# EAGLE design RPi_Secure_v1_2 (EAGLE 6.6.0)
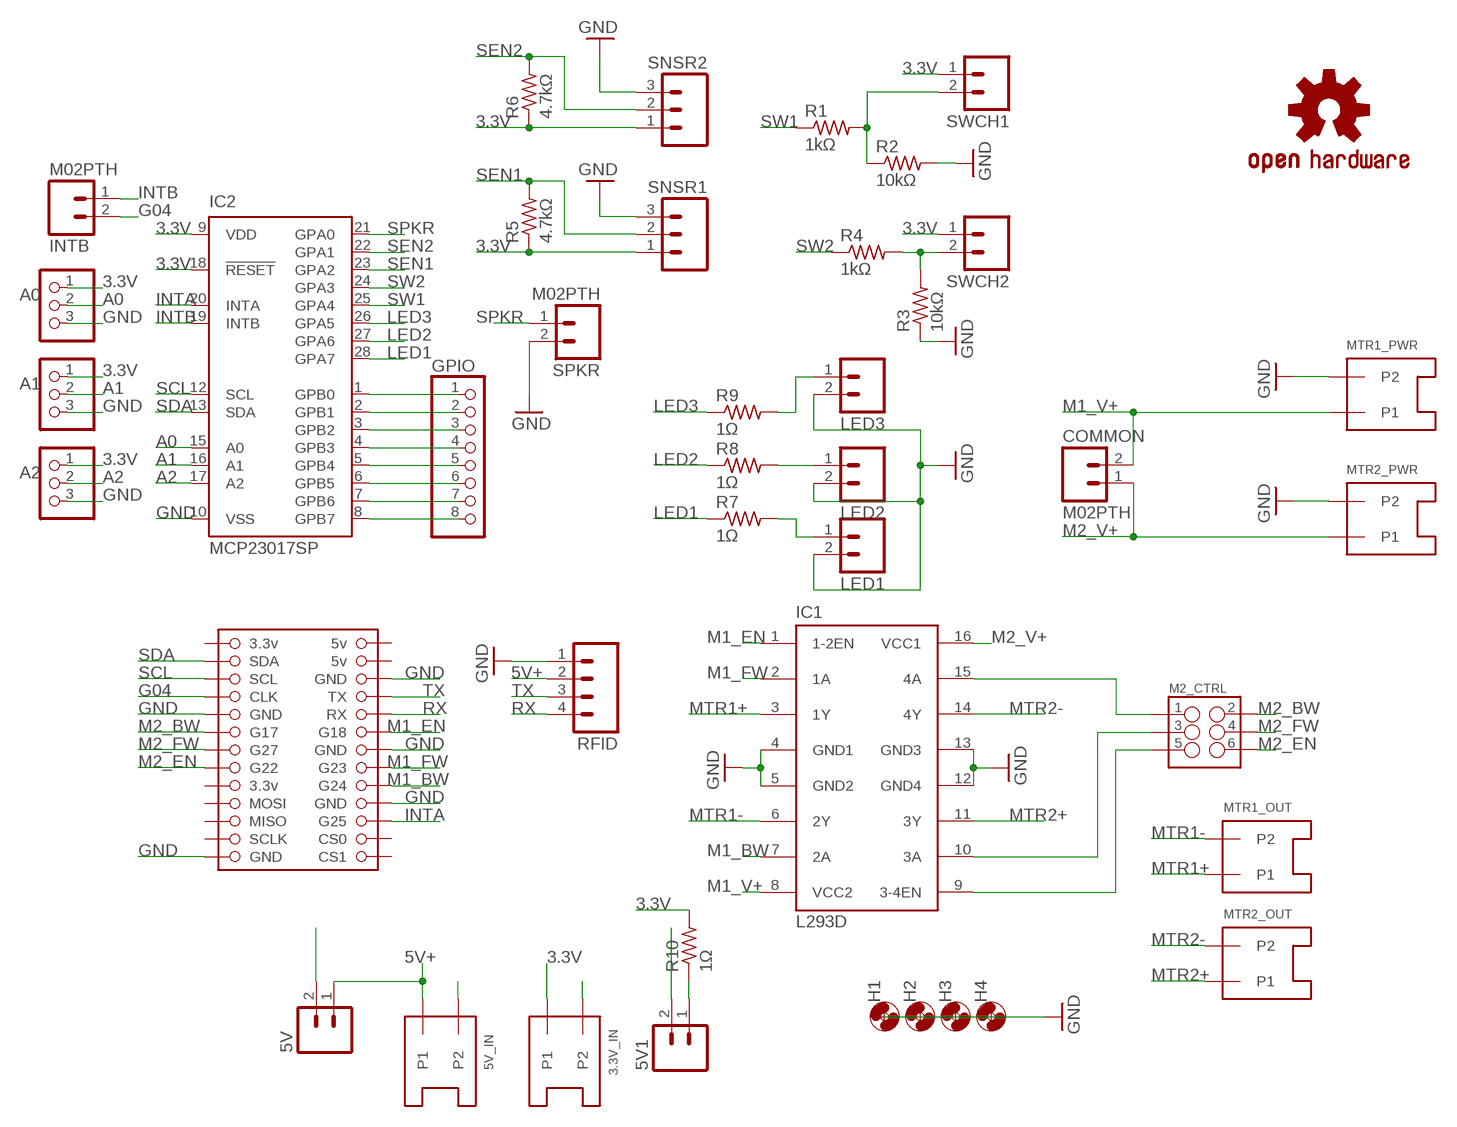
[diagram p0: schematic, sheet 1]

## Parts
3.3V_IN  S2B-XH-AS2B-XH-A  [S2B-XH-A]
5V  M02PTH  [1X02]
5V1  M02PTH  [1X02]
5V_IN  S2B-XH-AS2B-XH-A  [S2B-XH-A]
A0  PINHD-1X3  [1X03]
A1  PINHD-1X3  [1X03]
A2  PINHD-1X3  [1X03]
COMMON  M02PTH  [1X02]
GPIO  PINHD-1X8  [1X08]
H1  MOUNT-HOLE2.8  [2,8]
H2  MOUNT-HOLE2.8  [2,8]
H3  MOUNT-HOLE2.8  [2,8]
H4  MOUNT-HOLE2.8  [2,8]
IC1  L293D  [DIL16]
IC2  MCP23017SP  [DIL28-3]
INTB  M02PTH  [1X02]
JP1  1112RPI_EXTRA_LONG  [1112]
LED1  M02PTH  [1X02]
LED2  M02PTH  [1X02]
LED3  M02PTH  [1X02]
LOGO2  OSHW-LOGOM  [OSHW-LOGO-M]
M2_CTRL  M03X22X3_SILK_SM  [2X3]
MTR1_OUT  S2B-XH-AS2B-XH-A  [S2B-XH-A]
MTR1_PWR  S2B-XH-AS2B-XH-A  [S2B-XH-A]
MTR2_OUT  S2B-XH-AS2B-XH-A  [S2B-XH-A]
MTR2_PWR  S2B-XH-AS2B-XH-A  [S2B-XH-A]
R1  1kΩ  R-US_R0805  [R0805]
R2  10kΩ  R-US_R0805  [R0805]
R3  10kΩ  R-US_R0805  [R0805]
R4  1kΩ  R-US_R0805  [R0805]
R5  4.7kΩ  R-US_R0805  [R0805]
R6  4.7kΩ  R-US_R0805  [R0805]
R7  1Ω  R-US_R0805  [R0805]
R8  1Ω  R-US_R0805  [R0805]
R9  1Ω  R-US_R0805  [R0805]
R10  1Ω  R-US_R0805  [R0805]
RFID  M04PTH  [1X04]
SNSR1  M03PTH  [1X03]
SNSR2  M03PTH  [1X03]
SPKR  M02PTH  [1X02]
SWCH1  M02PTH  [1X02]
SWCH2  M02PTH  [1X02]

## Nets
3.3V: 3.3V_IN.P1 A0.1 A1.1 A2.1 IC2.9(VDD) IC2.18(!RESET) R5.1 R6.1 R10.2 SNSR1.1 SNSR2.1 SWCH1.1 SWCH2.1
5V+ [power]: 5V.1 5V_IN.P1 RFID.2
A0: A0.2 IC2.15(A0)
A1: A1.2 IC2.16(A1)
A2: A2.2 IC2.17(A2)
G04: INTB.2 JP1.07
GND: 3.3V_IN.P2 5V1.2 5V.2 5V_IN.P2 A0.3 A1.3 A2.3 IC1.4(GND1) IC1.5(GND2) IC1.12(GND4) IC1.13(GND3) IC2.10(VSS) JP1.06 JP1.09 JP1.14 JP1.20 JP1.25 LED1.2 LED2.2 LED3.2 MTR1_PWR.P2 MTR2_PWR.P2 R2.2 R3.1 RFID.1 SNSR1.3 SNSR2.3 SPKR.2
INTA: IC2.20(INTA) JP1.22
INTB: IC2.19(INTB) INTB.1
LED1: IC2.28(GPA7) R7.1
LED2: IC2.27(GPA6) R8.1
LED3: IC2.26(GPA5) R9.1
M1_BW: IC1.7(2A) JP1.18
M1_EN: IC1.1(1-2EN) JP1.12
M1_FW: IC1.2(1A) JP1.16
M1_V+ [power]: COMMON.2 IC1.8(VCC2) MTR1_PWR.P1
M2_BW: JP1.11 M2_CTRL.2
M2_EN: JP1.15 M2_CTRL.6
M2_FW: JP1.13 M2_CTRL.4
M2_V+ [power]: COMMON.1 IC1.16(VCC1) MTR2_PWR.P1
MTR1+ [power]: IC1.3(1Y) MTR1_OUT.P1
MTR1- [power]: IC1.6(2Y) MTR1_OUT.P2
MTR2+ [power]: IC1.11(3Y) MTR2_OUT.P1
MTR2- [power]: IC1.14(4Y) MTR2_OUT.P2
N$1: LED1.1 R7.2
N$2: LED2.1 R8.2
N$3: LED3.1 R9.2
N$4: R3.2 R4.2 SWCH2.2
N$6: 5V1.1 R10.1
N$17: IC1.10(3A) M2_CTRL.3
N$18: IC1.15(4A) M2_CTRL.1
N$20: GPIO.1 IC2.1(GPB0)
N$21: GPIO.2 IC2.2(GPB1)
N$22: GPIO.3 IC2.3(GPB2)
N$23: GPIO.4 IC2.4(GPB3)
N$24: GPIO.5 IC2.5(GPB4)
N$25: GPIO.6 IC2.6(GPB5)
N$26: GPIO.7 IC2.7(GPB6)
N$27: GPIO.8 IC2.8(GPB7)
RX: JP1.10 RFID.4
SCL: IC2.12(SCL) JP1.05
SDA: IC2.13(SDA) JP1.03
SEN1: IC2.23(GPA2) R5.2 SNSR1.2
SEN2: IC2.22(GPA1) R6.2 SNSR2.2
SPKR: IC2.21(GPA0) SPKR.1
SW1: IC2.25(GPA4) R1.1 R1.2 R2.1 SWCH1.2
SW2: IC2.24(GPA3) R4.1
TX: JP1.08 RFID.3
X: IC1.9(3-4EN) M2_CTRL.5
Unconnected: JP1.19 JP1.21 JP1.23 JP1.24 JP1.26

## Power pins joined to a net without a drawn wire
01: JP1.01
02: JP1.02
04: JP1.04
17: JP1.17

## Library data of the parts
3.3V_IN 5V_IN MTR1_OUT MTR1_PWR MTR2_OUT MTR2_PWR = con-jst2:S2B-XH-A
5V 5V1 COMMON INTB LED1-LED3 SPKR SWCH1 SWCH2 = SparkFun-Connectors:M02: Standard 2-pin 0.1" header. Use with - straight break away headers ( PRT-00116) - right angle break away headers (PRT-00553) - swiss pins (PRT-00743) - machine pins (PRT-00117) - female headers (PRT-00115) Molex polarized connector foot print use with: PRT-08233 with associated crimp pins and housings. 2.54_SCREWTERM for use with PRT-10571. 3.5mm Screw Terminal footprints for PRT-08084 5mm Screw Terminal footprints for use with PRT-08433; MF: MOLEX; MPN: 22-28-4023; OC_NEWARK: 92C2171
A0 A1 A2 = adafruit2:PINHD-1X3: PIN HEADER; MPN: 22-28-4033; OC_NEWARK: 87K0730
GPIO = pinhead:PINHD-1X8: PIN HEADER; MF: MOLEX; MPN: 22-28-4080; OC_NEWARK: 56H2000
H1-H4 = holes:MOUNT-HOLE: MOUNTING HOLE with drill center marker
IC1 = st-microelectronics:L293D: PUSH-PULL 4 CHANNEL DRIVER; MPN: L293D; OC_FARNELL: 9589619; OC_NEWARK: 56P8249
IC2 = adafruit2:MCP23017: http://ww1.microchip.com/downloads/en/DeviceDoc/21952a.pdf Source: http://ww1.microchip.com/downloads/en/DeviceDoc/21952a.pdf; MF: MICROCHIP; MPN: MCP23017-E/SP; OC_NEWARK: 31K2959
JP1 = adafruit2:1112: PIN HEADER; OC_NEWARK: unknown
LOGO2 = SparkFun-Aesthetics:OSHW-LOGO: Open Source Hardware Logo This logo indicates the piece of hardware it is found on incorporates a OSHW license and/or adheres to the definition of open source hardware found here: http://freedomdefined.org/OSHW; OC_NEWARK: unknown
M2_CTRL = SparkFun-Connectors:M03X2: 2x3 .1" header. Shrouded, with keying- CONN-10681 SMT- CONN-11415 Pogo pins- HW-11044; OC_NEWARK: unknown
R1-R10 = resistor:R-US_: RESISTOR, American symbol
RFID = SparkFun-Connectors:M04: Header 4 Standard 4-pin 0.1" header. Use with straight break away headers (SKU : PRT-00116), right angle break away headers (PRT-00553), swiss pins (PRT-00743), machine pins (PRT-00117), and female headers (PRT-00115). Molex polarized connector foot print use with SKU : PRT-08231 with associated crimp pins and housings. 1MM SMD Version SKU: PRT-10208; MPN: 22-28-4040; OC_NEWARK: 29X1962
SNSR1 SNSR2 = SparkFun-Connectors:M03: Header 3 Standard 3-pin 0.1" header. Use with straight break away headers (SKU : PRT-00116), right angle break away headers (PRT-00553), swiss pins (PRT-00743), machine pins (PRT-00117), and female headers (PRT-00115). Molex polarized connector foot print use with SKU : PRT-08232 with associated crimp pins and housings.; MPN: 22-28-4033; OC_NEWARK: 87K0730

## Net classes
1 power: width 0.607 mm, clearance 0.305 mm

## Board
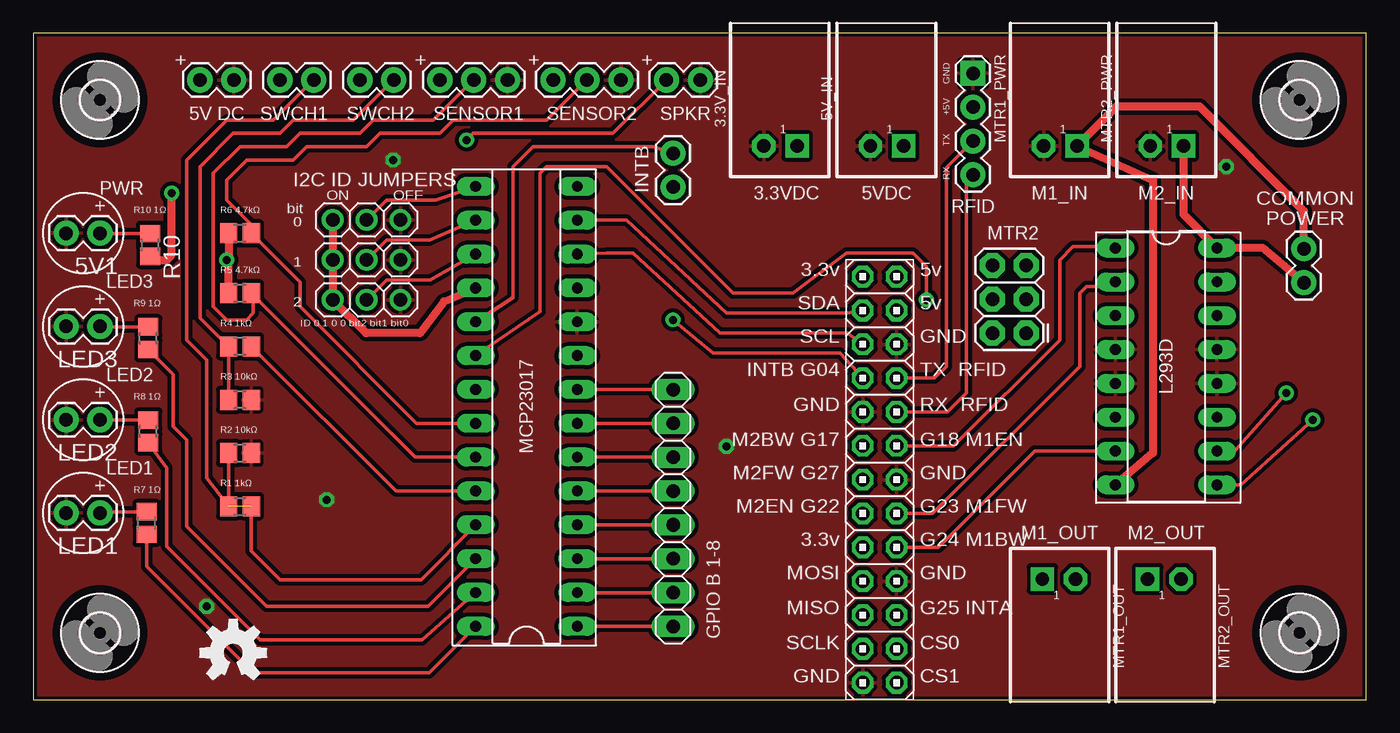
[diagram p1: board, top side]
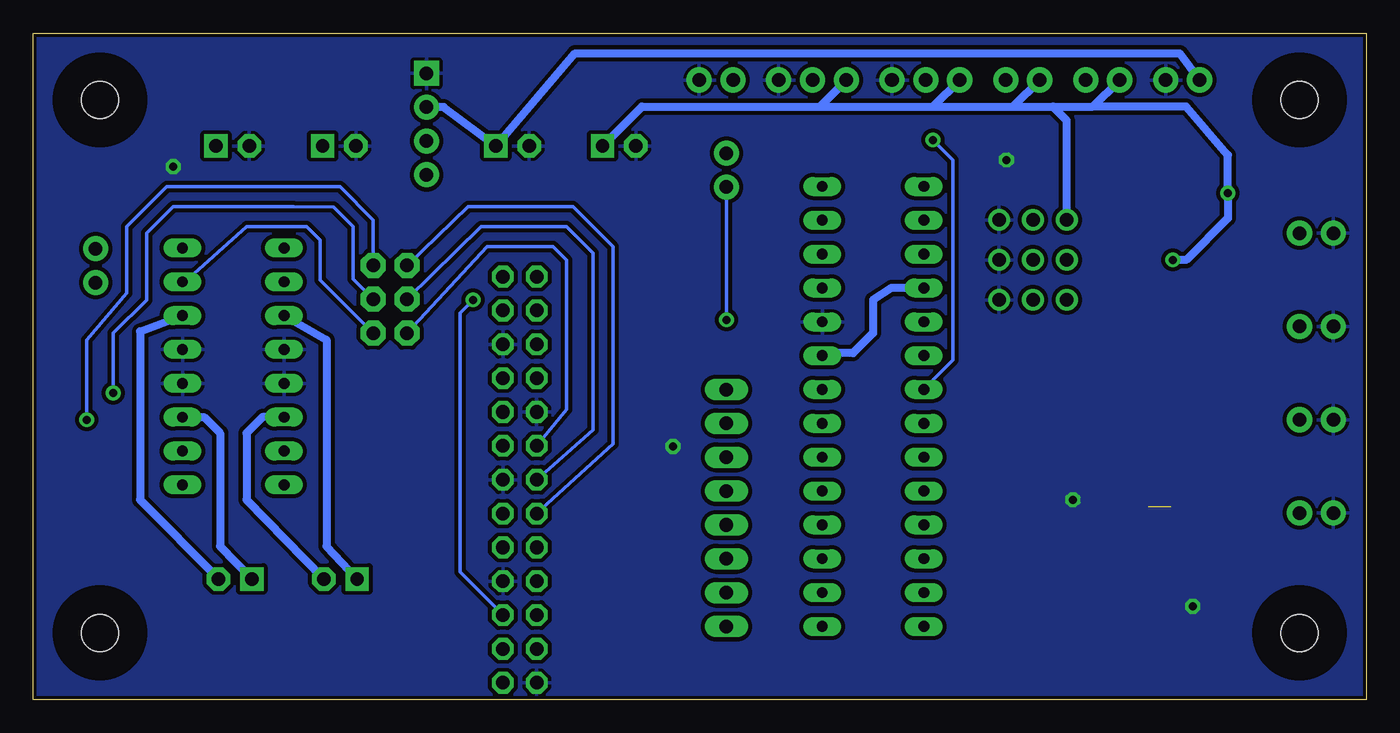
[diagram p2: board, bottom side, seen from below]

Size 100 x 50 mm. Coordinates in mm from the lower left corner, seen from the top.
Outline: 0,0 100,0 100,50 0,50 0,0
Copper layers (1*2*15*16): Top 0.035mm / dielectric 0.2mm / layer 2 0.0175mm / dielectric 1.1mm / layer 15 0.0175mm / dielectric 0.2mm / Bottom 0.035mm
Design rules "SeeedStudio_DRU_no_angle_20130527 *": minimum track width 6mil, minimum drill 12mil, track to track 12mil, track to pad 12mil, pad to pad 12mil, via to via 12mil, smd to smd 0mil, copper to edge 10mil, drill to drill 10mil, minimum pad ring 12mil, minimum via ring 10mil, stop-mask expansion 2mil, vias tented up to drill 25mil, thermal gap 10mil

### Footprints (pad centres in the part's own frame; a part is rotated, then mirrored left to right if it is on the bottom)
S2B-XH-A = drill 1 pad 1.75 square: P1 1.3,-3.45 | drill 1 pad 1.75 octagon: P2 -1.2,-3.45
1X02 = drill 1.016 pad 1.88: 1 0,0; 2 2.54,0
1X03 = drill 1.016: 1 -2.54,0; 2 0,0; 3 2.54,0
1X08 = drill 1.016 long: 1 -8.89,0; 2 -6.35,0; 3 -3.81,0; 4 -1.27,0; 5 1.27,0; 6 3.81,0; 7 6.35,0; 8 8.89,0
2,8 = hole 2.8: 0,0
DIL16 = drill 0.813 long: 1 -8.89,-3.81; 2 -6.35,-3.81; 3 -3.81,-3.81; 4 -1.27,-3.81; 5 1.27,-3.81; 6 3.81,-3.81; 7 6.35,-3.81; 8 8.89,-3.81; 9 8.89,3.81; 10 6.35,3.81; 11 3.81,3.81; 12 1.27,3.81; 13 -1.27,3.81; 14 -3.81,3.81; 15 -6.35,3.81; 16 -8.89,3.81
DIL28-3 = drill 0.813 long: 1 -16.51,-3.81; 2 -13.97,-3.81; 3 -11.43,-3.81; 4 -8.89,-3.81; 5 -6.35,-3.81; 6 -3.81,-3.81; 7 -1.27,-3.81; 8 1.27,-3.81; 9 3.81,-3.81; 10 6.35,-3.81; 11 8.89,-3.81; 12 11.43,-3.81; 13 13.97,-3.81; 14 16.51,-3.81; 15 16.51,3.81; 16 13.97,3.81; 17 11.43,3.81; 18 8.89,3.81; 19 6.35,3.81; 20 3.81,3.81; 21 1.27,3.81; 22 -1.27,3.81; 23 -3.81,3.81; 24 -6.35,3.81; 25 -8.89,3.81; 26 -11.43,3.81; 27 -13.97,3.81; 28 -16.51,3.81
1112 = drill 1.016 octagon: 01 -1.27,15.24; 02 1.27,15.24; 03 -1.27,12.7; 04 1.27,12.7; 05 -1.27,10.16; 06 1.27,10.16; 07 -1.27,7.62; 08 1.27,7.62; 09 -1.27,5.08; 10 1.27,5.08; 11 -1.27,2.54; 12 1.27,2.54; 13 -1.27,0; 14 1.27,0; 15 -1.27,-2.54; 16 1.27,-2.54; 17 -1.27,-5.08; 18 1.27,-5.08; 19 -1.27,-7.62; 20 1.27,-7.62; 21 -1.27,-10.16; 22 1.27,-10.16; 23 -1.27,-12.7; 24 1.27,-12.7; 25 -1.27,-15.24; 26 1.27,-15.24
2X3 = drill 1.016 pad 1.88 octagon: 1 0,0; 2 0,2.54; 3 2.54,0; 4 2.54,2.54; 5 5.08,0; 6 5.08,2.54
R0805 = smd 1.3 x 1.5: 1 -0.85,0; 2 0.85,0
1X04 = drill 1.016 pad 1.88 square: 1 0,0 | drill 1.016 pad 1.88: 2 2.54,0; 3 5.08,0; 4 7.62,0
1X03' = drill 1.016 pad 1.88: 1 0,0; 2 2.54,0; 3 5.08,0

### Placement (x,y rotation side)
3.3V_IN  56,45 0 top
5V  12.5,46.5 0 top
5V1  5,35 180 top
5V_IN  64,45 0 top
A0  25,36 0 top
A1  25,33 0 top
A2  25,30 0 top
COMMON  95.33,31.29 90 top
GPIO  48,14.38 90 top
H1  5,5 0 top
H2  95,5 0 top
H3  95,45 0 top
H4  5,45 0 top
IC1  85,25 270 top
IC2  37,22 90 top
INTB  48,41 270 top
JP1  63.5,16.5 0 top
LED1  5,14 180 top
LED2  5,21 180 top
LED3  5,28 180 top
LOGO2  15,3.5 0 top
M2_CTRL  74.5,27.5 90 top
MTR1_OUT  77,5.6 180 top
MTR1_PWR  77,45 0 top
MTR2_OUT  84.91,5.6 180 top
MTR2_PWR  85,45 0 top
R1  15.5,14.5 0 top
R2  15.5,18.5 0 top
R3  15.5,22.5 180 top
R4  15.5,26.5 180 top
R5  15.5,30.5 0 top
R6  15.5,35 0 top
R7  8.5,13.25 90 top
R8  8.62,20.12 90 top
R9  8.62,27.12 90 top
R10  8.75,34.12 270 top
RFID  70.5,47 270 top
SNSR1  [1X03']  30.5,46.5 0 top
SNSR2  [1X03']  39,46.5 0 top
SPKR  47.5,46.5 0 top
SWCH1  18.5,46.5 0 top
SWCH2  24.5,46.5 0 top

### Tracks (layer width: path | path; a pad name or v marks a point on that pad's centre or on a via)
3.3V  (via drill 0.6)
  Top 0.254: 14.65,33.15 v14.5,33 14.65,32.85
  Top 0.61: A0.1 A1.1 A2.1 24.96,27.5 29,27.5 30.8,29.88 IC2.18 | R10.2 9.03,33 10,33 10.38,33.38 v10.38,38 | R6.1 14.65,33.15 | R5.1 14.65,32.85
  Bottom 0.61: IC2.18 35.61,30.89 37,30 37,27.5 38.5,26 40.62,26 IC2.9 | 3.3V_IN.P1 54.35,44.5 41,44.5 | 41,44.5 32.5,44.5 | 32.5,44.5 26.5,44.5 | 26.5,44.5 23.5,44.5 | 23.5,44.5 20.5,44.5 | 20.5,44.5 SWCH1.1 | SWCH2.1 26.5,44.5 | SNSR1.1 32.5,44.5 | SNSR2.1 41,44.5 | A0.1 22.46,43.46 23.5,44.5 | 20.5,44.5 13.5,44.5 10.38,40.88 v10.38,38 10.38,36.12 13.5,33 v14.5,33
5V+
  Bottom 0.61: RFID.2 69.21,44.46 5V_IN.P1 59.35,48.5 14,48.5 5V.1
A0
  Top 0.254: A0.2 26.5,37.5 30.18,37.5 IC2.15
A1
  Top 0.254: A1.2 26.5,34.5 29.72,34.5 IC2.16
A2
  Top 0.254: A2.2 26.5,31.5 29.76,31.5 IC2.17
G04  (via drill 0.6)
  Top 0.254: JP1.07 60.5,26 51,26 v48,28.5
  Bottom 0.254: v48,28.5 INTB.2
GND  (via drill 0.6)
  other vias: 52,19 89.5,40 27,40.5 13,7 22,15
  pour Top: -0.5,50.5 101,50.5 101,-1 13,-1 13,-8.5 -0.5,-8.5
  pour Bottom: -1,51 101.5,51 101.5,-8 87,-8 87,-1.5 -1,-1.5
INTA  (via drill 0.6)
  Top 0.254: IC2.20 38,29.12 38,39.5 38.5,40 43,40 52.5,30.5 57,30.5 61,33.5 66,33.5 67,32.5 v67,30
  Bottom 0.254: JP1.22 68,9.57 68,29 v67,30
INTB
  Top 0.254: IC2.19 36,30.16 36,40 37.5,41.5 46.5,41.5 INTB.1
LED1
  Top 0.254: IC2.28 29.69,1.99 16.5,1.99 8.5,9.99 R7.1
LED2
  Top 0.254: R8.1 10,17.4 10,11.5 17,4.5 29.16,4.5 IC2.27
LED3
  Top 0.254: R9.1 10.5,24.4 10.5,20.5 11.5,19.5 11.5,13 17.5,7 29.62,7 IC2.26
M1_BW
  Top 0.254: JP1.18 67.92,11.42 75.15,18.65 IC1.7
M1_EN
  Top 0.254: JP1.12 69.04,19.04 77,27 77,33 78,34 81.08,34 IC1.1
M1_FW
  Top 0.254: JP1.16 67.46,13.96 78.5,25 78.5,30.5 79,31 80.84,31 IC1.2
M1_V+
  Top 0.61: IC1.8 84,18.5 84,39 MTR1_PWR.P1 81.25,44.5 87.5,44.5 95.33,36.67 COMMON.2
M2_BW
  Bottom 0.254: JP1.11 60,21.77 60,33 61,34 65.96,34 M2_CTRL.2
M2_EN
  Bottom 0.254: JP1.15 56.5,19.19 56.5,34 59.5,37 67.38,37 M2_CTRL.6
M2_FW
  Bottom 0.254: JP1.13 58,20.23 58,33.5 60,35.5 66.42,35.5 M2_CTRL.4
M2_V+
  Top 0.61: COMMON.1 92.23,33.89 IC1.16 86.3,36.4 MTR2_PWR.P1
MTR1+
  Bottom 0.61: IC1.3 78,27 78,11.5 MTR1_OUT.P1
MTR1-
  Bottom 0.61: IC1.6 82.81,21.19 84,20 84,15 MTR1_OUT.P2
MTR2+
  Bottom 0.61: IC1.11 87.19,21.19 86,20 86,11.5 MTR2_OUT.P1
MTR2-
  Bottom 0.61: IC1.14 92,27.62 92,15 MTR2_OUT.P2
N$1
  Top 0.254: LED1.1 5.1,14.1 R7.2
N$2
  Top 0.254: LED2.1 5.03,20.98 R8.2
N$3
  Top 0.254: LED3.1 5.03,27.98 R9.2
N$4
  Top 0.254: R3.2 R4.2 12.5,28.65 12.5,40 15,42.5 18.5,42.5 19.5,43.5 24,43.5 27,46.5 SWCH2.2
N$6
  Top 0.254: 5V1.1 5.03,34.98 R10.1
N$17  (via drill 0.6)
  Top 0.254: v94,23 90.15,18.65 IC1.10
  Bottom 0.254: v94,23 94,27.5 91.5,30 91.5,35 89.5,37 80.46,37 77.46,36.96 76,35.5 76,31.54 M2_CTRL.3
N$18
  Bottom 0.254: IC1.15 88.65,31.35 84,35.5 79.5,35.5 78.5,34.5 78.5,31.5 M2_CTRL.1
N$20
  Top 0.254: GPIO.1 IC2.1
N$21
  Top 0.254: IC2.2 GPIO.2
N$22
  Top 0.254: IC2.3 GPIO.3
N$23
  Top 0.254: IC2.4 GPIO.4
N$24
  Top 0.254: IC2.5 GPIO.5
N$25
  Top 0.254: IC2.6 GPIO.6
N$26
  Top 0.254: IC2.7 GPIO.7
N$27
  Top 0.254: IC2.8 GPIO.8
RX
  Top 0.254: RFID.4 70,38.88 70,23 68.58,21.58 JP1.10
SCL
  Top 0.254: JP1.05 61.07,27.5 51.5,27.5 45,33.5 43,33.5 41.07,33.43 IC2.12
SDA
  Top 0.254: IC2.13 42.5,36 44.5,36 52,29 61,29 JP1.03
SEN1
  Top 0.254: SNSR1.2 33,46.5 30,43.5 25.5,43.5 24.5,42.5 20,42.5 19,41.5 15.5,41.5 13.5,39.5 13.5,29.5 14.5,28.5 16,28.5 16.5,29 16.5,30.35 R5.2 28.66,18.19 IC2.23
SEN2
  Top 0.254: SNSR2.2 41.5,46.5 38.5,43.5 31.5,43.5 30.5,42.5 26,42.5 25,41.5 20.5,41.5 19.5,40.5 16,40.5 14.5,39 14.5,37.5 16.35,35.65 R6.2 20,31.35 20,29.5 28.77,20.73 IC2.22
SPKR  (via drill 0.6)
  Top 0.254: SPKR.1 43.5,42.5 33,42.5 v32.5,42
  Bottom 0.254: IC2.21 33.23,23.27 31,25.5 31,40.5 v32.5,42
SW1  (1 unrouted)
  Top 0.254: R2.1 R1.1 13,16.65 13,25.5 11.5,27 11.5,40.5 14.5,43.5 18,43.5 21,46.5 SWCH1.2 | R1.2 16.35,11.15 18.5,9 29.08,9 IC2.25
SW2
  Top 0.254: R4.1 27.2,15.65 IC2.24
TX
  Top 0.254: RFID.3 68.5,39.92 68.5,25 67.62,24.12 JP1.08
X  (via drill 0.6)
  Top 0.254: v96,21 90.61,16.11 IC1.9
  Bottom 0.254: v96,21 96,27 93,30.5 93,35.5 90,38.5 77,38.5 74.5,36 M2_CTRL.5

### Text on the board
tPlace: + | + | + | + | GND | 5V DC | SWCH1 | SWCH2 | SENSOR1 | SENSOR2 | SPKR | +5V | TX | RX | + | PWR | I2C ID JUMPERS | ON | OFF | 3.3VDC | 5VDC | RFID | M1_IN | M2_IN | R10 1Ω | R6 4.7kΩ | COMMON / POWER | bit | 0 | MTR2 | R5 4.7kΩ | 1 | 3.3v | 5v | LED3 | + | R9 1Ω | 2 | SDA | 5v | R4 1kΩ | ID 0 1 0 0 bit2 bit1 bit0 | SCL | GND | INTB G04 | TX RFID | L293D | + | LED2 | R3 10kΩ | R8 1Ω | MCP23017 | GND | RX RFID | R2 10kΩ | M2BW G17 | G18 M1EN | LED1 | M2FW G27 | GND | + | R7 1Ω | R1 1kΩ | M2EN G22 | G23 M1FW | 3.3v | G24 M1BW | M1_OUT | M2_OUT | MOSI | GND | GPIO B 1-8 | MISO | G25 INTA | SCLK | CS0 | GND | CS1
Document: RPi Secure / 2014-08-13 v1.2 / https://github.com/mike-heckman/RPiSecure